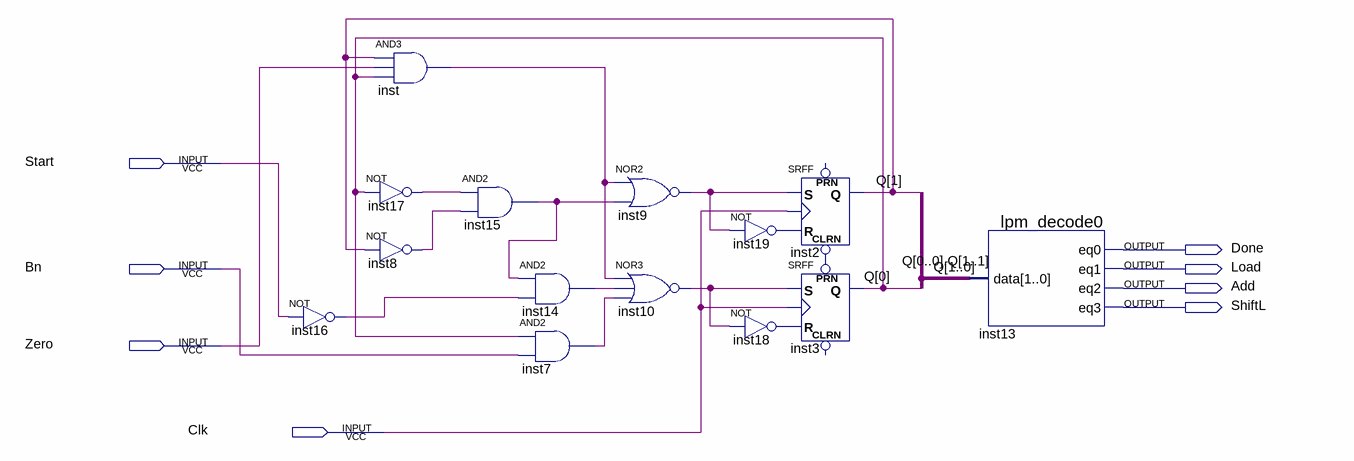
[diagram p0: schematic sheet]
// Quartus schematic UA.bdf as structural Verilog: 14 symbols, 8 pins
module UA (
  input  Start,
  input  Bn,
  input  Zero,
  input  Clk,
  output Done,
  output Load,
  output Add,
  output ShiftL
);

  wire inst7_out, inst8_out, inst9_out, inst10_out, inst14_out, inst15_out, inst16_out, inst17_out,
       inst18_out, inst19_out, inst_out, undriven;
  wire [1:0] Q;

  not inst16 (inst16_out, Start);
  and inst (inst_out, Q[1], Zero, Q[0]);
  not inst17 (inst17_out, Q[0]);
  not inst8 (inst8_out, Q[1]);
  and inst15 (inst15_out, inst17_out, inst8_out);
  and inst14 (inst14_out, inst15_out, inst16_out);
  and inst7 (inst7_out, Q[0], Bn);
  nor inst9 (inst9_out, inst_out, inst15_out);
  nor inst10 (inst10_out, inst_out, inst14_out, inst7_out);
  not inst19 (inst19_out, inst9_out);
  not inst18 (inst18_out, inst10_out);
  SRFF inst2 (.CLRN(undriven), .S(inst9_out), .R(inst19_out), .CLK(Clk), .Q(Q[1]));  // open: PRN
  SRFF inst3 (.PRN(undriven), .S(inst10_out), .R(inst18_out), .CLK(Clk), .Q(Q[0]));  // open: CLRN
  lpm_decode0 inst13 (.data(Q), .eq0(Done), .eq1(Load), .eq2(Add), .eq3(ShiftL));
endmodule
